# Altium project ETBC.PrjPcb
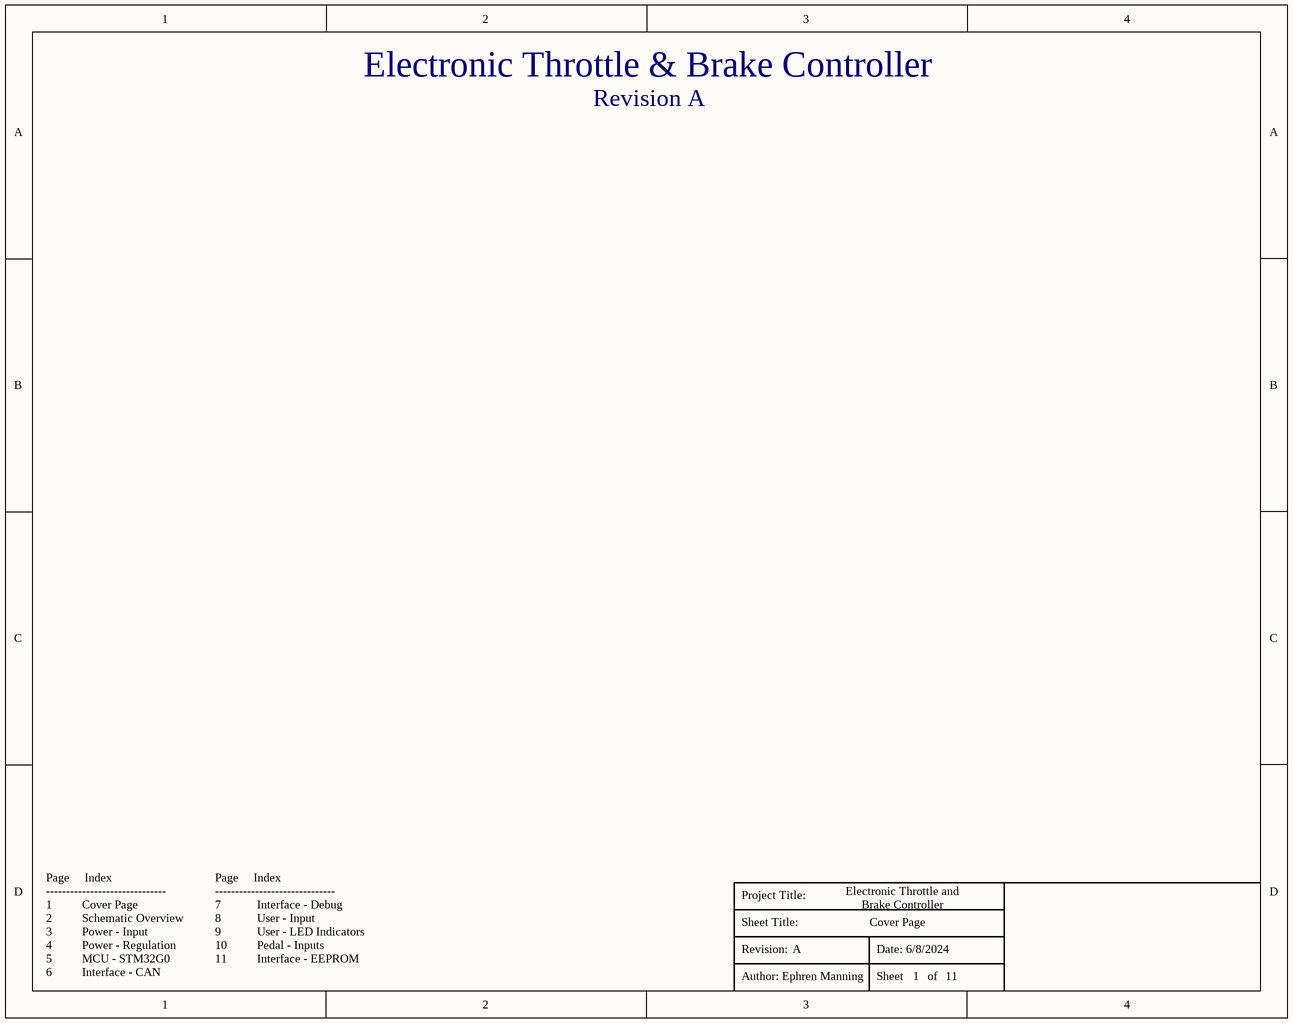
[diagram p0: Cover Page.SchDoc]
11 sheets, 104 parts. Net scope: hierarchical (ports join the sheet entries above them; power ports are global).
Board file: ETBC.PcbDoc
Sheets:
  Cover Page.SchDoc
  Overview.SchDoc
    MCU = MCU.SchDoc
    Interface - EEPROM = Interface - EEPROM.SchDoc
    Interface - CAN = Interface - CAN.SchDoc
    Interface - Debug = Interface - Debug.SchDoc
    Input - Pedals = Input - Pedals.SchDoc
    Power - Input = Power - Input.SchDoc
    Power - Regulation = Power - Regulation.SchDoc
    User - Input = User - Input.SchDoc
    User - LED Indicators = User - LED Indicators.SchDoc

## Sheet Cover Page.SchDoc
size A; SheetNumber: 1; SheetTotal: 11

### Notes on the sheet
- Electronic Throttle & Brake Controller
- Revision A
- Electronic Throttle and
  Brake Controller
- A
- Cover Page
- 6/8/2024
- Page     Index
  ------------------------------
  1          Cover Page
  2          Schematic Overview
  3          Power - Input
  4          Power - Regulation
  5          MCU - STM32G0
  6          Interface - CAN
- Page     Index
  ------------------------------
  7            Interface - Debug
  8            User - Input
  9            User - LED Indicators
  10          Pedal - Inputs
  11          Interface - EEPROM
- Ephren Manning
- 1
- 11
- Project Title:
- Sheet Title:
- Revision:
- Date:
- Author:
- Sheet        of

## Sheet Overview.SchDoc
size A; SheetNumber: 2; SheetTotal: 11
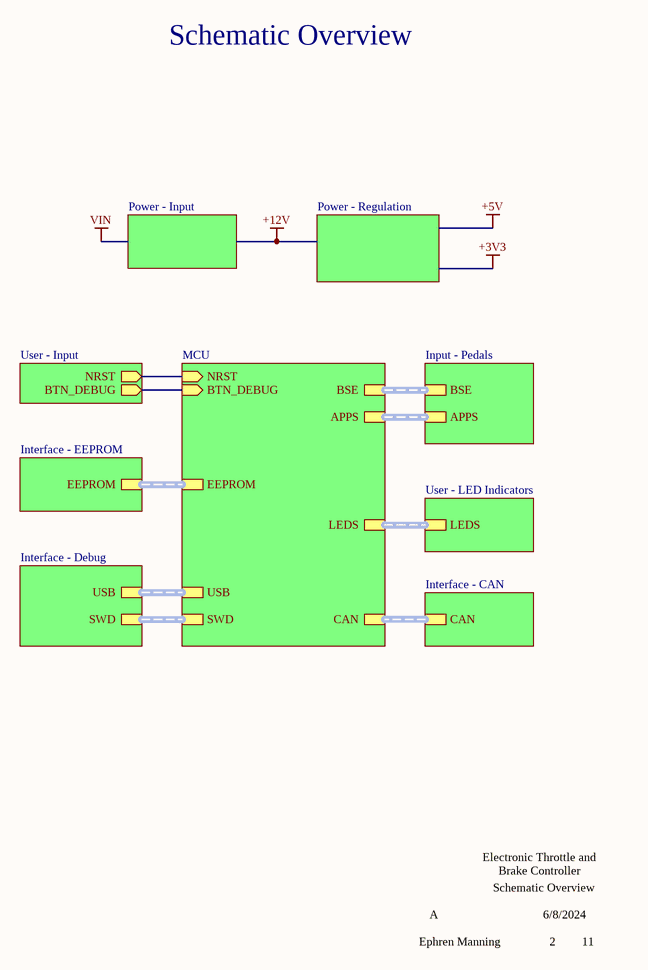
[diagram p1: Overview.SchDoc]

### Sub-sheets
Input - Pedals = Input - Pedals.SchDoc: BSE (harness BSE), APPS (harness APPS)
Interface - CAN = Interface - CAN.SchDoc: CAN (harness CAN)
Interface - Debug = Interface - Debug.SchDoc: SWD (harness SWD), USB (harness USB)
Interface - EEPROM = Interface - EEPROM.SchDoc: EEPROM (harness EEPROM)
MCU = MCU.SchDoc: CAN (harness CAN), SWD (harness SWD), USB (harness USB), LEDS (harness LEDS), EEPROM (harness EEPROM), APPS (harness APPS), BSE (harness BSE), NRST (in), BTN_DEBUG (in)
Power - Input = Power - Input.SchDoc: no entries
Power - Regulation = Power - Regulation.SchDoc: no entries
User - Input = User - Input.SchDoc: NRST (out), BTN_DEBUG (out)
User - LED Indicators = User - LED Indicators.SchDoc: LEDS (harness LEDS)

### Nets
BTN_DEBUG: sheet MCU/BTN_DEBUG, sheet User - Input/BTN_DEBUG
NRST: sheet MCU/NRST, sheet User - Input/NRST

### Buses and harness runs
harness sheet Input - Pedals/APPS = sheet MCU/APPS
harness sheet Input - Pedals/BSE = sheet MCU/BSE
harness sheet Interface - CAN/CAN = sheet MCU/CAN
harness sheet Interface - Debug/SWD = sheet MCU/SWD
harness sheet Interface - Debug/USB = sheet MCU/USB
harness sheet Interface - EEPROM/EEPROM = sheet MCU/EEPROM
harness sheet MCU/LEDS = sheet User - LED Indicators/LEDS

### Notes on the sheet
- Schematic Overview
- Electronic Throttle and
  Brake Controller
- A
- 6/8/2024
- Ephren Manning
- 2
- 11
- Project Title:
- Sheet Title:
- Revision:
- Date:
- Author:
- Sheet        of

## Sheet MCU.SchDoc
size A; SheetNumber: 5; SheetTotal: 11
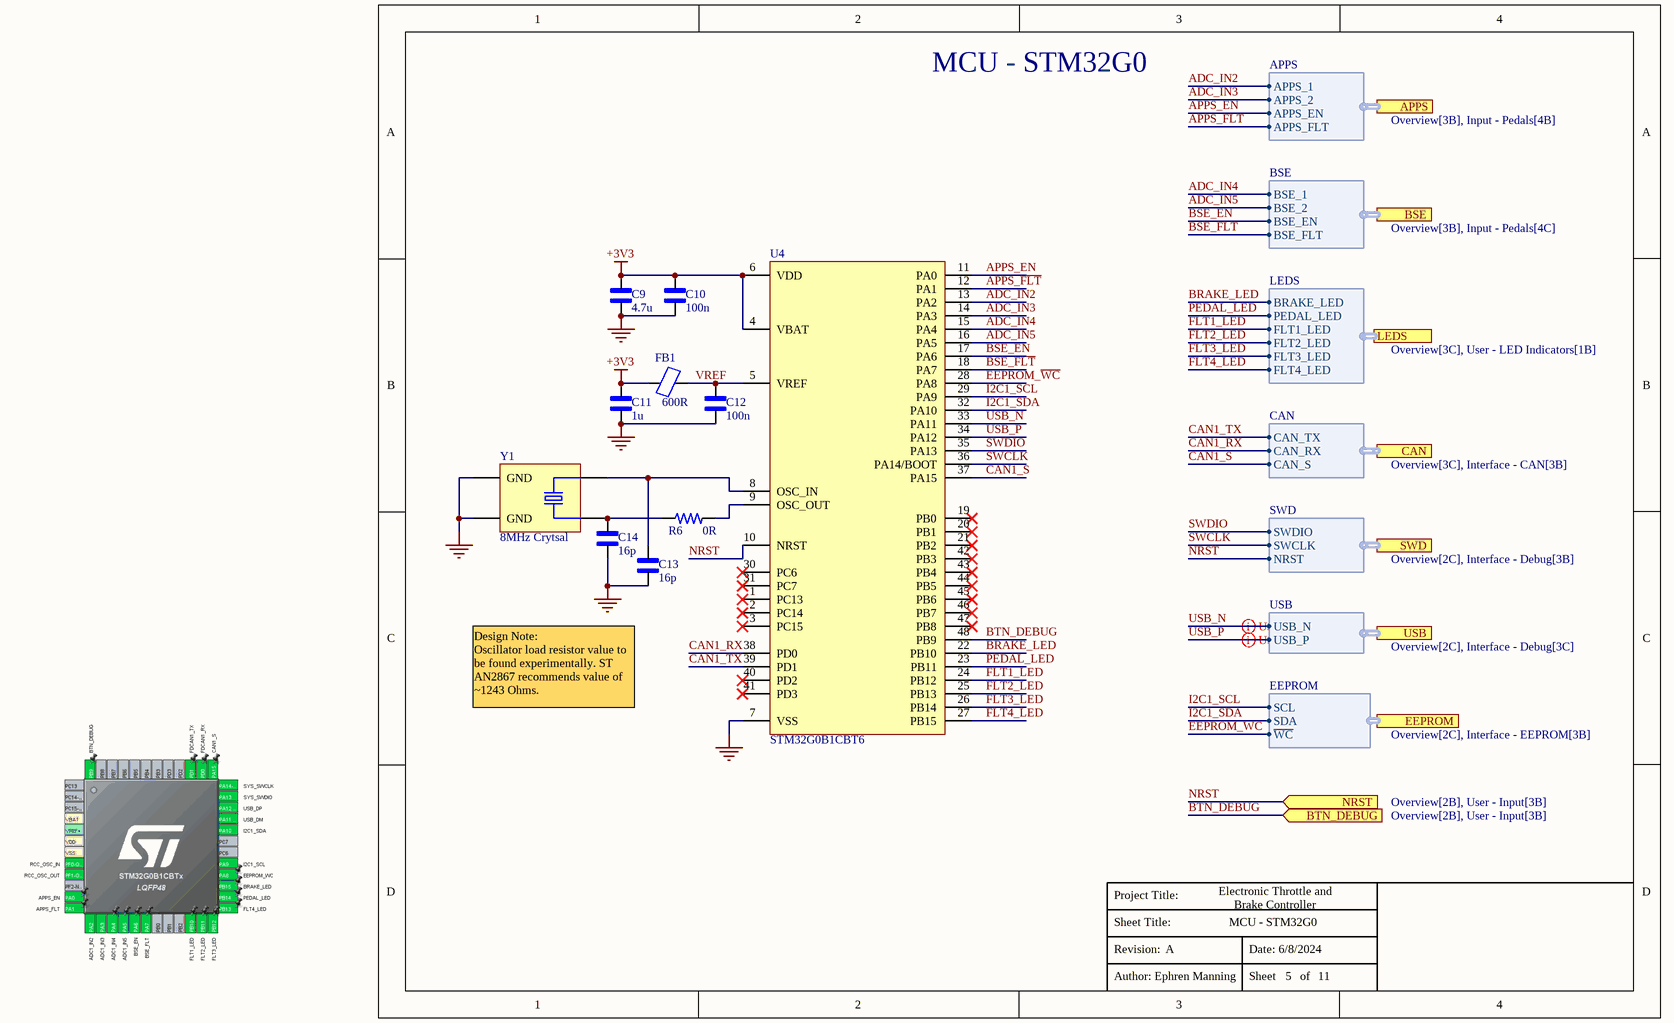
[diagram p2: MCU.SchDoc]

### Parts
C9  4.7u  [CAP_0402-Footprint-1]
C10  100n  [CAP_0402-Footprint-1]
C11  1u  [CAP_0402-Footprint-1]
C12  100n  [CAP_0402-Footprint-1]
C13  16p  [CAP_0402-Footprint-1]
C14  16p  [CAP_0402-Footprint-1]
FB1  600R  [FB_0402-Footprint-1]
R6  0R  [RES_0402-Footprint-1]
U4  STM32G0B1CBT6  [STM32G0-LQFP48]
Y1  ECS-80-18-33-JGN-TR  [XTAL_ECS-240-8-33-AGN-TR]  (value not drawn)

### Ports
APPS (harness APPS, see Overview[3B], Input - Pedals[4B]), BSE (harness BSE, see Overview[3B], Input - Pedals[4C]), BTN_DEBUG (in, see Overview[2B], User - Input[3B]), CAN (harness CAN, see Overview[3C], Interface - CAN[3B]), EEPROM (harness EEPROM, see Overview[2C], Interface - EEPROM[3B]), LEDS (harness LEDS, see Overview[3C], User - LED Indicators[1B]), NRST (in, see Overview[2B], User - Input[3B]), SWD (harness SWD, see Overview[2C], Interface - Debug[3B]), USB (harness USB, see Overview[2C], Interface - Debug[3C])

### Harnesses
CAN: CAN_TX, CAN_RX, CAN_S
SWD: SWDIO, SWCLK, NRST
USB: USB_N, USB_P
LEDS: BRAKE_LED, PEDAL_LED, FLT1_LED, FLT2_LED, FLT3_LED, FLT4_LED
EEPROM: SCL, SDA, ~{WC}
APPS: APPS_1, APPS_2, APPS_EN, APPS_FLT
BSE: BSE_1, BSE_2, BSE_EN, BSE_FLT

### Nets
+3V3: C9.2 C10.2 C11.2 FB1.1 U4.4(VBAT) U4.6(VDD)
GND: C9.1 C10.1 C11.1 C12.1 C13.2 C14.1 U4.7(VSS) Y1.2(GND) Y1.4(GND)
ADC_IN2: U4.13(PA2) ; port APPS.APPS_1
ADC_IN3: U4.14(PA3) ; port APPS.APPS_2
ADC_IN4: U4.15(PA4) ; port BSE.BSE_1
ADC_IN5: U4.16(PA5) ; port BSE.BSE_2
APPS_EN: U4.11(PA0) ; port APPS.APPS_EN
APPS_~{FLT}: U4.12(PA1) ; port APPS.APPS_FLT
BRAKE_LED: U4.22(PB10) ; port LEDS.BRAKE_LED
BSE_EN: U4.17(PA6) ; port BSE.BSE_EN
BSE_~{FLT}: U4.18(PA7) ; port BSE.BSE_FLT
BTN_DEBUG: U4.48(PB9) ; port BTN_DEBUG
CAN1_RX: U4.38(PD0) ; port CAN.CAN_RX
CAN1_S: U4.37(PA15) ; port CAN.CAN_S
CAN1_TX: U4.39(PD1) ; port CAN.CAN_TX
EEPROM_~{WC}: U4.28(PA8) ; port EEPROM.~{WC}
FLT1_LED: U4.24(PB12) ; port LEDS.FLT1_LED
FLT2_LED: U4.25(PB13) ; port LEDS.FLT2_LED
FLT3_LED: U4.26(PB14) ; port LEDS.FLT3_LED
FLT4_LED: U4.27(PB15) ; port LEDS.FLT4_LED
I2C1_SCL: U4.29(PA9) ; port EEPROM.SCL
I2C1_SDA: U4.32(PA10) ; port EEPROM.SDA
NRST: U4.10(NRST) ; port NRST, port SWD.NRST
PEDAL_LED: U4.23(PB11) ; port LEDS.PEDAL_LED
SWCLK: U4.36(PA14/BOOT) ; port SWD.SWCLK
SWDIO: U4.35(PA13) ; port SWD.SWDIO
USB_N: U4.33(PA11) ; port USB.USB_N
USB_P: U4.34(PA12) ; port USB.USB_P
VREF: C12.2 FB1.2 U4.5(VREF)
NetC13_1: C13.1 U4.8(OSC_IN) Y1.1(IN/OUT)
NetC14_2: C14.2 R6.1 Y1.3(OUT/IN)
NetR6_2: R6.2 U4.9(OSC_OUT)

Not connected (* = marked no-connect by the designer): U4 1(PC13)* 2(PC14)* 3(PC15)* 19(PB0)* 20(PB1)* 21(PB2)* 30(PC6)* 31(PC7)* 40(PD2)* 41(PD3)* 42(PB3)* 43(PB4)* 44(PB5)* 45(PB6)* 46(PB7)* 47(PB8)*

### Layout directives
differential pair: USB_N, USB_P

### Notes on the sheet
- MCU - STM32G0
- (near Y1) 8MHz Crytsal
- Design Note:
  Oscillator load resistor value to be found experimentally. ST AN2867 recommends value of ~1243 Ohms.
- Electronic Throttle and
  Brake Controller
- A
- 6/8/2024
- Ephren Manning
- 5
- 11
- Project Title:
- Sheet Title:
- Revision:
- Date:
- Author:
- Sheet        of

### Library data of the parts
C9 = CMP-00067-3: 4.7uF 10V 20% 0402 CAP; Manufacturer Part Number 1: CL05A475MP5NRNC; Manufacturer 1: Samsung Electro-Mechanics; Digikey Part Number: 1276-1482-1-ND
C10 C12 = CMP-00066-3: 100nF 10V 10% 0402 CAP; Manufacturer 1: Samsung Electro-Mechanics; Manufacturer Part Number 1: CL05B104KP5NNNC; Digikey Part Number: 1276-1002-1-ND
C11 = CMP-00068-3: 1uF 10V 10% 0402 CAP; Manufacturer Part Number 1: CL05A105KP5NNNC; Manufacturer 1: Samsung Electro-Mechanics; Digikey Part Number: 1276-1076-1-ND
C13 C14 = CMP-00065-1: 16pF 50V 1% 0402 Ceramic Capacitor; Manufacturer Part Number 1: GJM1555C1H160FB01J; Manufacturer 1: Murata Electronics; Digikey Part Number: 490-GJM1555C1H160FB01JCT-ND
FB1 = CMP-00069-1: 600R@100MHz 300mA 0402 Ferrite Bead; Manufacturer 1: Murata Electronics; Manufacturer Part Number 1: BLM15AG601SN1D; Digikey Part Number: 490-1006-1-ND
R6 = CMP-00070-1: 0 Ohm 1/16W 0402 Resistor; Manufacturer 1: YAGEO; Manufacturer Part Number 1: RC0402JR-070RL; Digikey Part Number: 311-0.0JRCT-ND
U4 = CMP-00062-7: 32-bit Cortex-M0+ MCU 48LQFP; Manufacturer 1: STMicroelectronics; Digikey Part Number: 497-STM32G0B1CBT6-ND; Manufacturer Part Number 1: STM32G0B1CBT6
Y1 = CMP-128-000000-3: 8MHz ±20ppm 18pF Crystal; Manufacturer 1: ECS Inc.; Digikey Part Number: 50-ECS-80-18-33-JGN-CT-ND; Manufacturer Part Number 1: ECS-80-18-33-JGN-TR

## Sheet Interface - EEPROM.SchDoc
size A; SheetNumber: 11; SheetTotal: 11
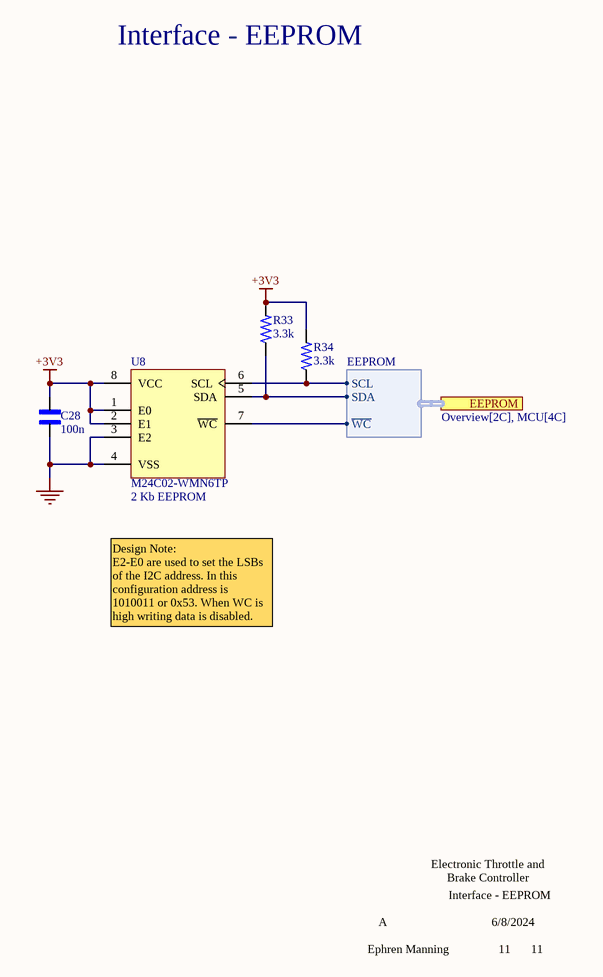
[diagram p3: Interface - EEPROM.SchDoc]

### Parts
C28  100n  [CAP_0402-Footprint-1]
R33  3.3k  [RES_0402-Footprint-1]
R34  3.3k  [RES_0402-Footprint-1]
U8  M24C02-WMN6TP  [FP-SO8N-SO-A-IPC_B]

### Ports
EEPROM (harness EEPROM, see Overview[2C], MCU[4C])

### Harnesses
EEPROM: SCL, SDA, ~{WC}

### Nets
+3V3: C28.2 R33.2 R34.2 U8.1(E0) U8.2(E1) U8.8(VCC)
GND: C28.1 U8.3(E2) U8.4(VSS)
EEPROM_~{WC}: U8.7(~{WC}) ; port EEPROM.~{WC}
I2C1_SCL: R34.1 U8.6(SCL) ; port EEPROM.SCL
I2C1_SDA: R33.1 U8.5(SDA) ; port EEPROM.SDA

### Notes on the sheet
- Interface - EEPROM
- (near U8) 2 Kb EEPROM
- Design Note:
  E2-E0 are used to set the LSBs of the I2C address. In this configuration address is 1010011 or 0x53. When WC is high writing data is disabled.
- Electronic Throttle and
  Brake Controller
- A
- 6/8/2024
- Ephren Manning
- 11
- Project Title:
- Sheet Title:
- Revision:
- Date:
- Author:
- Sheet        of

### Library data of the parts
C28 = CMP-00066-3: 100nF 10V 10% 0402 CAP; Manufacturer Part Number 1: CL05B104KP5NNNC; Manufacturer 1: Samsung Electro-Mechanics; Digikey Part Number: 1276-1002-1-ND
R33 R34 = CMP-00091-1: 3.3k 1% 1/16W 0402 Thick Film; Manufacturer 1: YAGEO; Manufacturer Part Number 1: RC0402FR-073K3L; Digikey Part Number: 311-3.30KLRCT-ND
U8 = CMP-00089-1: 2Kb I2C EEPROM; Manufacturer 1: STMicroelectronics; Manufacturer Part Number 1: M24C02-WMN6TP; Digikey Part Number: 497-8552-1-ND

## Sheet Interface - CAN.SchDoc
size A; SheetNumber: 6; SheetTotal: 11
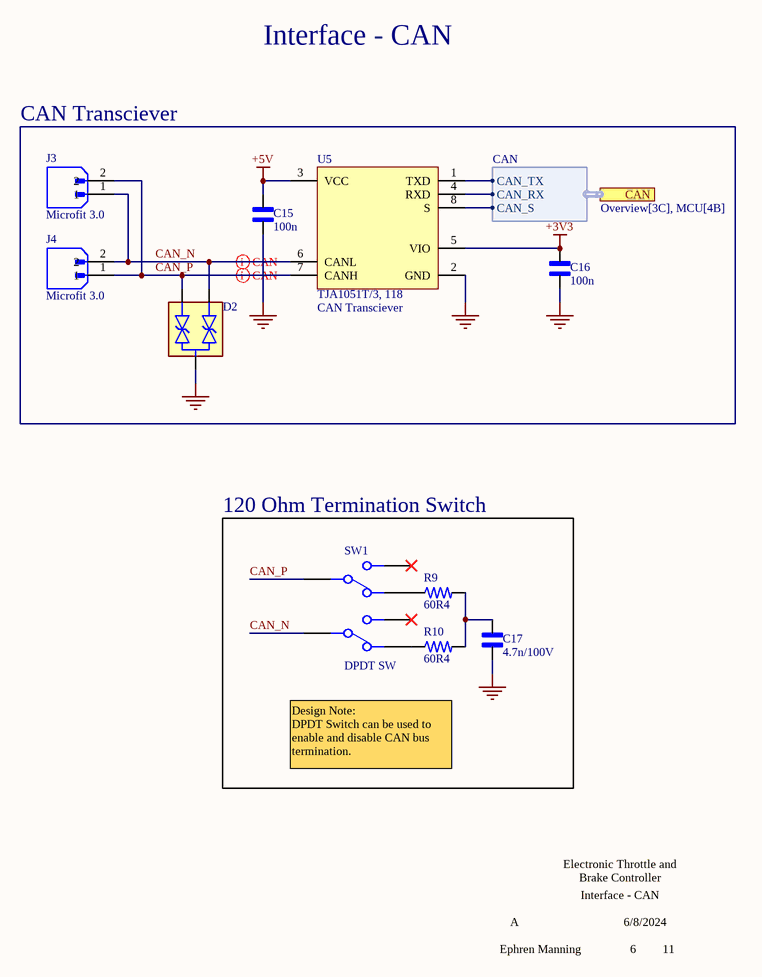
[diagram p4: Interface - CAN.SchDoc]

### Parts
C15  100n  [CAP_0402-Footprint-1]
C16  100n  [CAP_0402-Footprint-1]
C17  4.7n/100V  [CAP_0402-Footprint-1]
D2  ESD2CANFD24DBZRQ1  [SOT95P237X112-3N]  (value not drawn)
J3  Microfit 3.0  [MOLEX_436500216]
J4  Microfit 3.0  [MOLEX_436500216]
R9  60R4  [RES_0402-Footprint-1]
R10  60R4  [RES_0402-Footprint-1]
SW1  DPDT SW  [SW_JS202011JCQN]
U5  TJA1051T/3, 118  [SOIC127P600X175-8N]

### Blocks framed on the sheet
CAN Transciever: C15 C16 D2 J3 J4 U5
120 Ohm Termination Switch: C17 R9 R10 SW1

### Ports
CAN (harness CAN, see Overview[3C], MCU[4B])

### Harnesses
CAN: CAN_TX, CAN_RX, CAN_S

### Nets
+3V3: C16.2 U5.5(VIO)
+5V: C15.2 U5.3(VCC)
GND: C15.1 C16.1 C17.1 D2.3(GND) U5.2(GND)
CAN1_RX: U5.4(RXD) ; port CAN.CAN_RX
CAN1_S: U5.8(S) ; port CAN.CAN_S
CAN1_TX: U5.1(TXD) ; port CAN.CAN_TX
CAN_N: D2.1(IO1) J3.1 J4.2 SW1.6 U5.6(CANL)
CAN_P: D2.2(IO2) J3.2 J4.1 SW1.2 U5.7(CANH)
NetC17_2: C17.2 R9.2 R10.2
NetR9_1: R9.1 SW1.3
NetR10_1: R10.1 SW1.7

Not connected (* = marked no-connect by the designer): SW1 1* 5*

### Layout directives
differential pair: CAN_N, CAN_P

### Notes on the sheet
- Interface - CAN
- (near U5) CAN Transciever
- Design Note:
  DPDT Switch can be used to enable and disable CAN bus termination.
- Electronic Throttle and
  Brake Controller
- A
- 6/8/2024
- Ephren Manning
- 6
- 11
- Project Title:
- Sheet Title:
- Revision:
- Date:
- Author:
- Sheet        of

### Library data of the parts
C15 C16 = CMP-00066-3: as C28 on sheet Interface - EEPROM; Digikey Part Number: 1276-1002-1-ND
C17 = CMP-00072-1: 4.7nF 100V 10% 0402 Ceramic Capacitor; Manufacturer 1: Murata Electronics; Manufacturer Part Number 1: GCM155R72A472KA37D; Digikey Part Number: 490-4765-1-ND
D2 = CMP-112-000000-3: Dual TVS Protection Diodes; Manufacturer 1: Texas Instruments; Digikey Part Number: 296-ESD2CANFD24DBZRQ1CT-ND; Manufacturer Part number 1: ESD2CANFD24DBZRQ1
J3 J4 = CMP-085-000002-2: 1x2 Gold Microfit; Manufacturer Part Number 1: 43650-0216; Manufacturer 1: Molex; Digikey Part Number: WM1922-ND
R9 R10 = CMP-00071-1: 60.4 Ohm 1% 1/16W 0402 Resistor; Manufacturer Part Number 1: RC0402FR-0760R4L; Manufacturer 1: YAGEO; Digikey Part Number: 311-60.4LRCT-ND
SW1 = CMP-114-000000-2: DPDT SMD SWITCH 6V 300MA; Manufacturer 1: C&K; Manufacturer Part Number 1: JS202011JCQN; Digikey Part Number: CKN10723CT-ND
U5 = CMP-00010-11: CAN Transceiver, NXP; Manufacturer 1: NXP USA Inc.; Manufacturer Part Number 1: TJA1051T/3,118; Digikey Part Number: 568-8684-1-ND

## Sheet Interface - Debug.SchDoc
size A; SheetNumber: 7; SheetTotal: 11
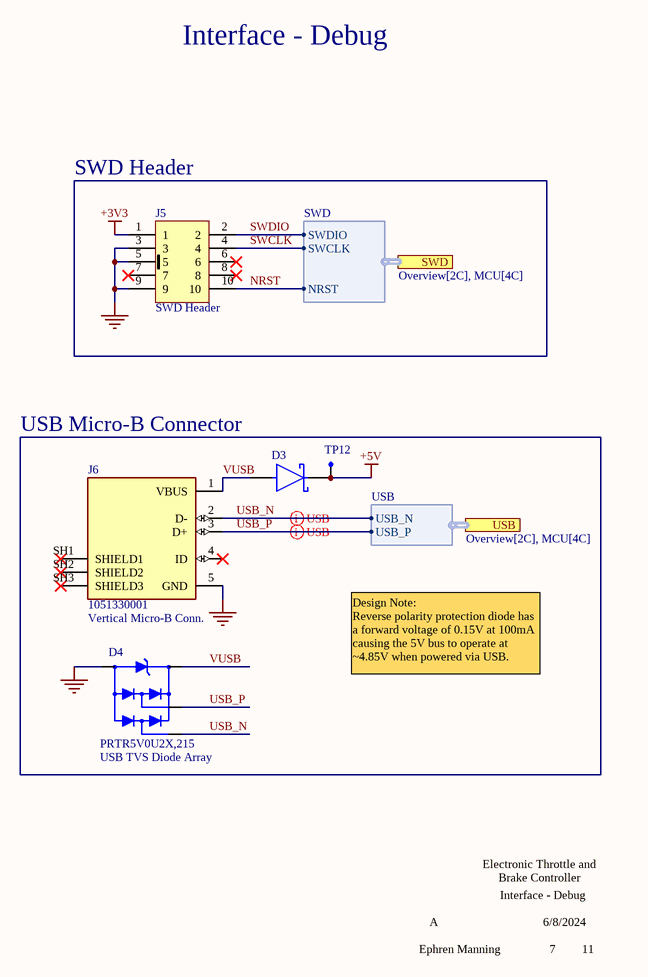
[diagram p5: Interface - Debug.SchDoc]

### Parts
D3  LSM115JE3/TR13  [DIOM4336X33N]  (value not drawn)
D4  PRTR5V0U2X,215  [SOT143B]
J5  SWD Header  [FCI_20021111-00010T4LF]
J6  1051330001  [MOLEX_1051330001]
TP12  SMD Testpoint  [SMD Testpoint-Footprint-1]  (value not drawn)

### Blocks framed on the sheet
SWD Header: J5
USB Micro-B Connector: D3 D4 J6 TP12

### Ports
SWD (harness SWD, see Overview[2C], MCU[4C]), USB (harness USB, see Overview[2C], MCU[4C])

### Harnesses
SWD: SWDIO, SWCLK, NRST
USB: USB_N, USB_P

### Nets
+3V3: J5.1
+5V: D3.2 TP12.1
GND: D4.1(P$1) J5.3 J5.5 J5.9 J6.5(GND)
NRST: J5.10 ; port SWD.NRST
SWCLK: J5.4 ; port SWD.SWCLK
SWDIO: J5.2 ; port SWD.SWDIO
USB_N: D4.3(P$3) J6.2(D-) ; port USB.USB_N
USB_P: D4.2(P$2) J6.3(D+) ; port USB.USB_P
VUSB: D3.1 D4.4(P$4) J6.1(VBUS)

Not connected (* = marked no-connect by the designer): J5 6* 7* 8*; J6 4(ID)* SH1(SHIELD1)* SH2(SHIELD2)* SH3(SHIELD3)*

### Layout directives
differential pair: USB_N, USB_P

### Notes on the sheet
- Interface - Debug
- Vertical Micro-B Conn.
- Design Note:
  Reverse polarity protection diode has a forward voltage of 0.15V at 100mA causing the 5V bus to operate at ~4.85V when powered via USB.
- (near D4) USB TVS Diode Array
- Electronic Throttle and
  Brake Controller
- A
- 6/8/2024
- Ephren Manning
- 7
- 11
- Project Title:
- Sheet Title:
- Revision:
- Date:
- Author:
- Sheet        of

### Library data of the parts
D3 = CMP-00073-1: 15V 1A Schottky Diode, Very Low Forward Voltage; Manufacturer 1: Microchip Technology; Digikey Part Number: 150-LSM115JE3/TR13CT-ND; Manufacturer Part Number 1: LSM115JE3/TR13
D4 = CMP-018-000000-5: Diode Array, ESD; Manufacturer 1: Nexperia USA Inc.; Manufacturer Part Number 1: PRTR5V0U2X,215; Digikey Part Number: 1727-3884-1-ND
J5 = CMP-118-000000-2: SWD Unshrouded Connector; Manufacturer 1: Amphenol ICC (FCI); Digikey Part Number: 609-3712-ND; Manufacturer Part Number 1: 20021111-00010T4LF
J6 = CMP-016-000000-6: Micro USB Type B 90 Degree Conn; Manufacturer 1: Molex; Manufacturer Part Number 1: 1051330001; Digikey Part Number: WM9734CT-ND
TP12 = CMP-00095-4: Flat 50x50mil Test Point

## Sheet Input - Pedals.SchDoc
size A; SheetNumber: 10; SheetTotal: 11
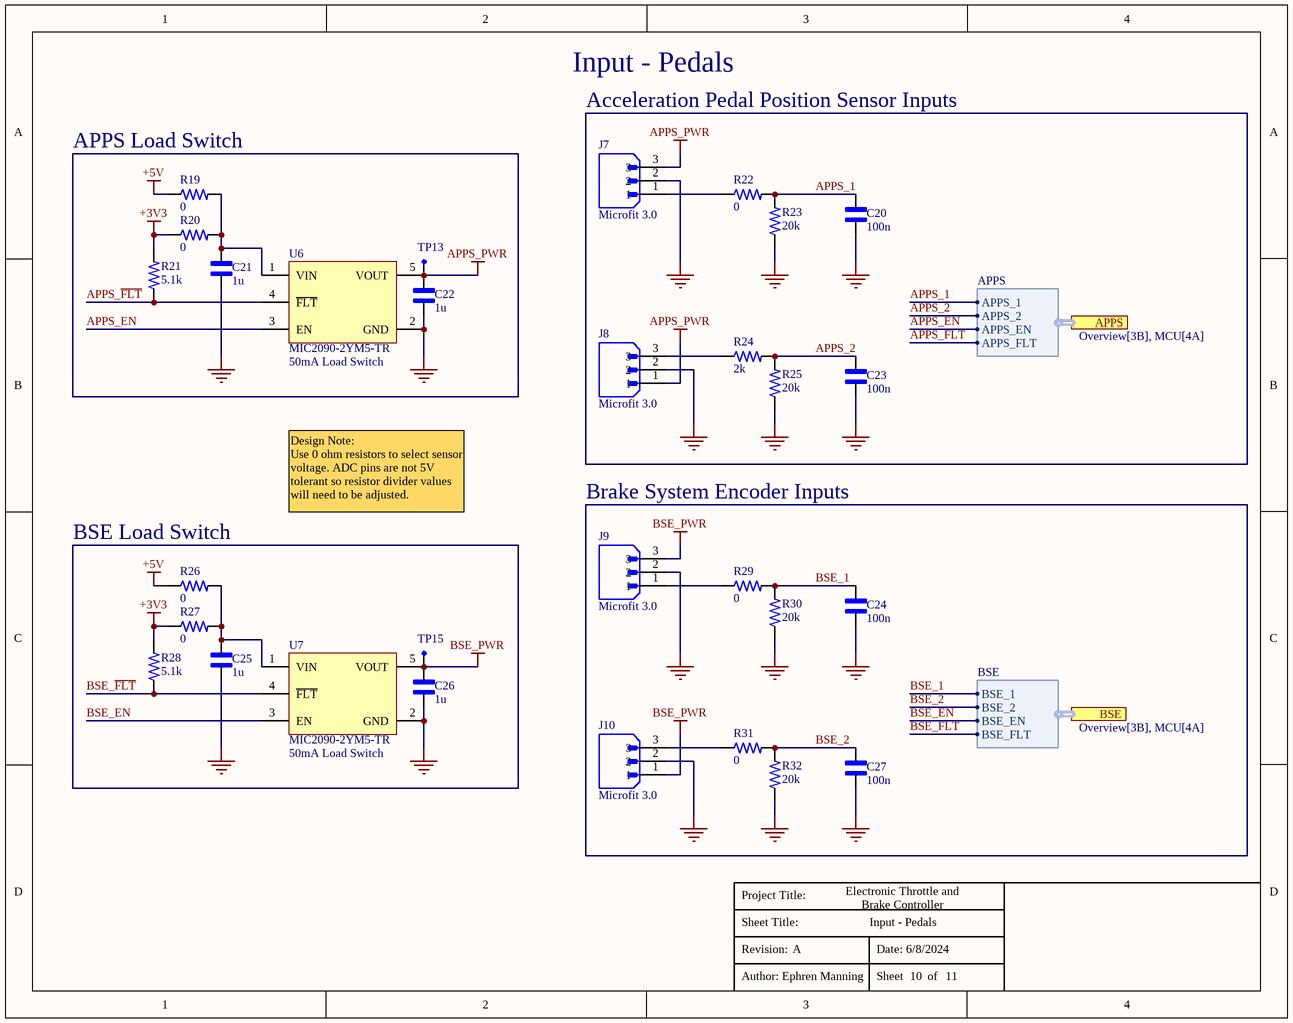
[diagram p6: Input - Pedals.SchDoc]

### Parts
C20  100n  [CAP_0402-Footprint-1]
C21  1u  [CAP_0402-Footprint-1]
C22  1u  [CAP_0402-Footprint-1]
C23  100n  [CAP_0402-Footprint-1]
C24  100n  [CAP_0402-Footprint-1]
C25  1u  [CAP_0402-Footprint-1]
C26  1u  [CAP_0402-Footprint-1]
C27  100n  [CAP_0402-Footprint-1]
J7  Microfit 3.0  [MOLEX_436500316]
J8  Microfit 3.0  [MOLEX_436500316]
J9  Microfit 3.0  [MOLEX_436500316]
J10  Microfit 3.0  [MOLEX_436500316]
R19  0  [RES_0402-Footprint-1]
R20  0  [RES_0402-Footprint-1]
R21  5.1k  [RES_0402-Footprint-1]
R22  0  [RES_0402-Footprint-1]
R23  20k  [RES_0402-Footprint-1]
R24  2k  [RES_0402-Footprint-1]
R25  20k  [RES_0402-Footprint-1]
R26  0  [RES_0402-Footprint-1]
R27  0  [RES_0402-Footprint-1]
R28  5.1k  [RES_0402-Footprint-1]
R29  0  [RES_0402-Footprint-1]
R30  20k  [RES_0402-Footprint-1]
R31  0  [RES_0402-Footprint-1]
R32  20k  [RES_0402-Footprint-1]
TP13  SMD Testpoint  [SMD Testpoint-Footprint-1]  (value not drawn)
TP15  SMD Testpoint  [SMD Testpoint-Footprint-1]  (value not drawn)
U6  MIC2090-2YM5-TR  [SOT95P275X110-5N]
U7  MIC2090-2YM5-TR  [SOT95P275X110-5N]

### Blocks framed on the sheet
Acceleration Pedal Position Sensor Inputs: C20 C23 J7 J8 R22-R25
APPS Load Switch: C21 C22 R19-R21 TP13 U6
Brake System Encoder Inputs: C24 C27 J9 J10 R29-R32
BSE Load Switch: C25 C26 R26-R28 TP15 U7

### Ports
APPS (harness APPS, see Overview[3B], MCU[4A]), BSE (harness BSE, see Overview[3B], MCU[4A])

### Harnesses
BSE: BSE_1, BSE_2, BSE_EN, BSE_FLT
APPS: APPS_1, APPS_2, APPS_EN, APPS_FLT

### Nets
+3V3: R20.1 R21.2 R27.1 R28.2
+5V: R19.1 R26.1
APPS_PWR: C22.2 J7.3 J8.1 TP13.1 U6.5(VOUT)
BSE_PWR: C26.2 J9.3 J10.1 TP15.1 U7.5(VOUT)
GND: C20.1 C21.1 C22.1 C23.1 C24.1 C25.1 C26.1 C27.1 J7.2 J8.2 J9.2 J10.2 R23.1 R25.1 R30.1 R32.1 U6.2(GND) U7.2(GND)
APPS_1: C20.2 R22.2 R23.2 ; port APPS.APPS_1  [project net ADC_IN2]
APPS_2: C23.2 R24.2 R25.2 ; port APPS.APPS_2  [project net ADC_IN3]
APPS_EN: U6.3(EN) ; port APPS.APPS_EN
APPS_~{FLT}: R21.1 U6.4(~{FLT}) ; port APPS.APPS_FLT
BSE_1: C24.2 R29.2 R30.2 ; port BSE.BSE_1  [project net ADC_IN4]
BSE_2: C27.2 R31.2 R32.2 ; port BSE.BSE_2  [project net ADC_IN5]
BSE_EN: U7.3(EN) ; port BSE.BSE_EN
BSE_~{FLT}: R28.1 U7.4(~{FLT}) ; port BSE.BSE_FLT
NetC21_2: C21.2 R19.2 R20.2 U6.1(VIN)
NetC25_2: C25.2 R26.2 R27.2 U7.1(VIN)
NetJ7_1: J7.1 R22.1
NetJ8_3: J8.3 R24.1
NetJ9_1: J9.1 R29.1
NetJ10_3: J10.3 R31.1

### Notes on the sheet
- Input - Pedals
- (near U6) 50mA Load Switch
- Design Note:
  Use 0 ohm resistors to select sensor voltage. ADC pins are not 5V tolerant so resistor divider values will need to be adjusted.
- (near U7) 50mA Load Switch
- Electronic Throttle and
  Brake Controller
- A
- 6/8/2024
- Ephren Manning
- 10
- 11
- Project Title:
- Sheet Title:
- Revision:
- Date:
- Author:
- Sheet        of

### Library data of the parts
C20 C23 C24 C27 = CMP-00066-3: as C28 on sheet Interface - EEPROM; Digikey Part Number: 1276-1002-1-ND
C21 C22 C25 C26 = CMP-00068-3: 1uF 10V 10% 0402 CAP; Manufacturer 1: Samsung Electro-Mechanics; Manufacturer Part Number 1: CL05A105KP5NNNC; Digikey Part Number: 1276-1076-1-ND
J7-J10 = CMP-085-000001-2: 1x3 Gold Microfit; Manufacturer 1: Molex; Manufacturer Part Number 1: 436500316; Digikey Part Number: WM1923-ND
R19 R20 R22 R26 R27 R29 R31 = CMP-00070-1: as R6 on sheet MCU; Digikey Part Number: 311-0.0JRCT-ND
R21 R28 = CMP-00074-1: 5.1k 1% 1/16W 0402 Resistor; Manufacturer 1: YAGEO; Manufacturer Part Number 1: RC0402FR-075K1L; Digikey Part Number: 311-5.10KLRCT-ND
R23 R25 R30 R32 = CMP-00081-1: 20k 0.1% 1/16W 0402 Thin Film; Manufacturer 1: YAGEO; Manufacturer Part Number 1: RT0402BRD0720KL; Digikey Part Number: YAG1388CT-ND
R24 = CMP-00080-1: 2k 0.1% 1/16W 0402 Thin Film; Manufacturer 1: YAGEO; Manufacturer Part Number 1: RT0402BRD072KL; Digikey Part Number: YAG2303CT-ND
TP13 TP15 = CMP-00095-4: Flat 50x50mil Test Point
U6 U7 = CMP-00085-1: 50mA Load Switch w/ Overcurrent Protection; Manufacturer 1: Microchip Technology; Digikey Part Number: 576-3964-1-ND; Manufacturer Part Number 1: MIC2090-2YM5-TR

## Sheet Power - Input.SchDoc
size A; SheetNumber: 3; SheetTotal: 11
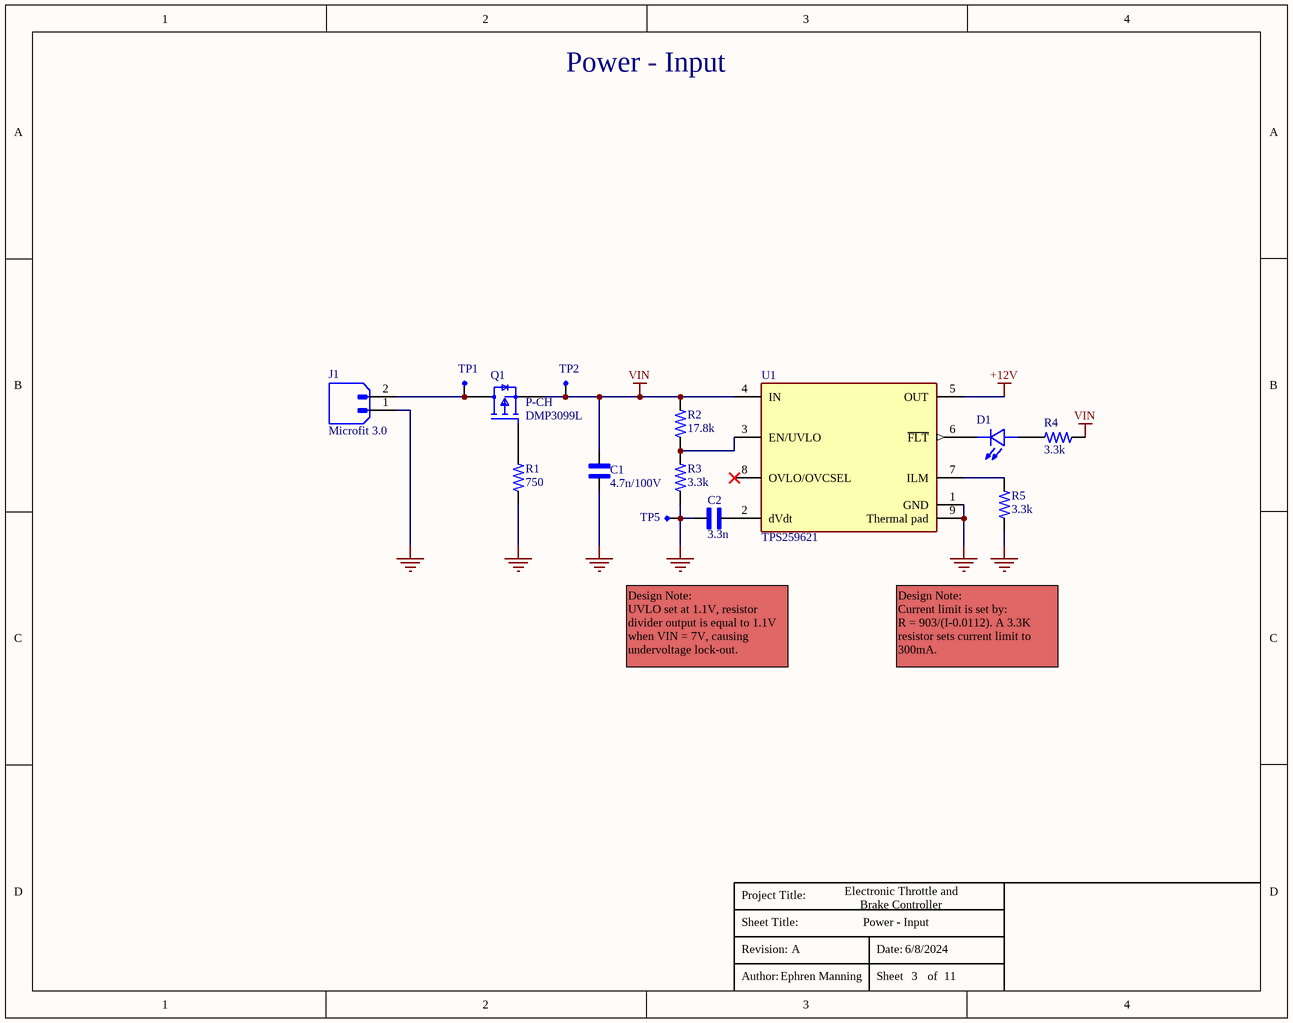
[diagram p7: Power - Input.SchDoc]

### Parts
C1  4.7n/100V  [CAP_0402-Footprint-1]
C2  3.3n  [CAP_0402-Footprint-1]
D1  150060RS75000  [LED_150060RS75000]  (value not drawn)
J1  Microfit 3.0  [MOLEX_436500216]
Q1  DMP3099L  [SOT95P242X110-3N]
R1  750  [RES_0402-Footprint-1]
R2  17.8k  [RES_0402-Footprint-1]
R3  3.3k  [RES_0402-Footprint-1]
R4  3.3k  [RES_0402-Footprint-1]
R5  3.3k  [RES_0402-Footprint-1]
TP1  SMD Testpoint  [SMD Testpoint-Footprint-1]  (value not drawn)
TP2  SMD Testpoint  [SMD Testpoint-Footprint-1]  (value not drawn)
TP5  SMD Testpoint  [SMD Testpoint-Footprint-1]  (value not drawn)
U1  TPS259621  [FP-DDA0008E-IPC_B]

### Nets
+12V: U1.5(OUT)
GND: C1.1 C2.1 J1.1 R1.1 R3.1 R5.1 TP5.1 U1.1(GND) U1.9(Thermal_pad)
VIN: C1.2 Q1.2(Source) R2.2 R4.1 TP2.1 U1.4(IN)
NetC2_2: C2.2 U1.2(dVdt)
NetD1_A: D1.A R4.2
NetD1_C: D1.C U1.6(~{FLT})
NetJ1_2: J1.2 Q1.3(Drain) TP1.1
NetQ1_1: Q1.1(Gate) R1.2
NetR2_1: R2.1 R3.2 U1.3(EN/UVLO)
NetR5_2: R5.2 U1.7(ILM)

Not connected (* = marked no-connect by the designer): U1 8(OVLO/OVCSEL)*

### Notes on the sheet
- Power - Input
- (near Q1) P-CH
- Design Note:
  UVLO set at 1.1V, resistor divider output is equal to 1.1V when VIN = 7V, causing undervoltage lock-out.
- Design Note:
  Current limit is set by:
  R = 903/(I-0.0112). A 3.3K resistor sets current limit to 300mA.
- Electronic Throttle and
  Brake Controller
- A
- 6/8/2024
- Ephren Manning
- 3
- 11
- Project Title:
- Sheet Title:
- Revision:
- Date:
- Author:
- Sheet        of

### Library data of the parts
C1 = CMP-00072-1: as C17 on sheet Interface - CAN; Digikey Part Number: 490-4765-1-ND
C2 = CMP-00088-1: 3.3nF 25V 0402 Ceramic Capacitor; Manufacturer 1: YAGEO; Manufacturer Part Number 1: CC0402KRX7R8BB332; Digikey Part Number: 311-3623-1-ND
D1 = CMP-120-000000-3: CLEAR RED LEAD 0603 2V Forward Voltage; Manufacturer 1: Würth Elektronik; Manufacturer Part Number 1: 150060RS75000; Digikey Part Number: 732-4978-1-ND
J1 = CMP-085-000002-2: as J3 on sheet Interface - CAN; Digikey Part Number: WM1922-ND
Q1 = CMP-00025-2: Mosfet P-CH 30V 3.8A Vgs(ON) = -10V SOT23; Manufacturer Part Number 1: DMP3099L-7; Manufacturer 1: Diodes Incorporated; Digikey Part Number: DMP3099L-7DICT-ND
R1 = CMP-00078-1: 750 1% 1/16W 0402 Thick Film; Manufacturer Part Number 1: RC0402FR-07750RL; Manufacturer 1: YAGEO; Digikey Part Number: 311-750LRCT-ND
R2 = CMP-00090-1: 17.8k 1% 1/16W 0402 Thick Film; Manufacturer 1: YAGEO; Manufacturer Part Number 1: RC0402FR-0717K8L; Digikey Part Number: YAG3012CT-ND
R3-R5 = CMP-00091-1: as R33 on sheet Interface - EEPROM; Digikey Part Number: 311-3.30KLRCT-ND
TP1 TP2 TP5 = CMP-00095-4: Flat 50x50mil Test Point
U1 = CMP-00086-2: 19V 2A EFUSE; Manufacturer 1: Texas Instruments; Manufacturer Part Number 1: TPS259621DDAT; Digikey Part Number: 296-TPS259621DDATCT-ND

## Sheet Power - Regulation.SchDoc
size A; SheetNumber: 4; SheetTotal: 11
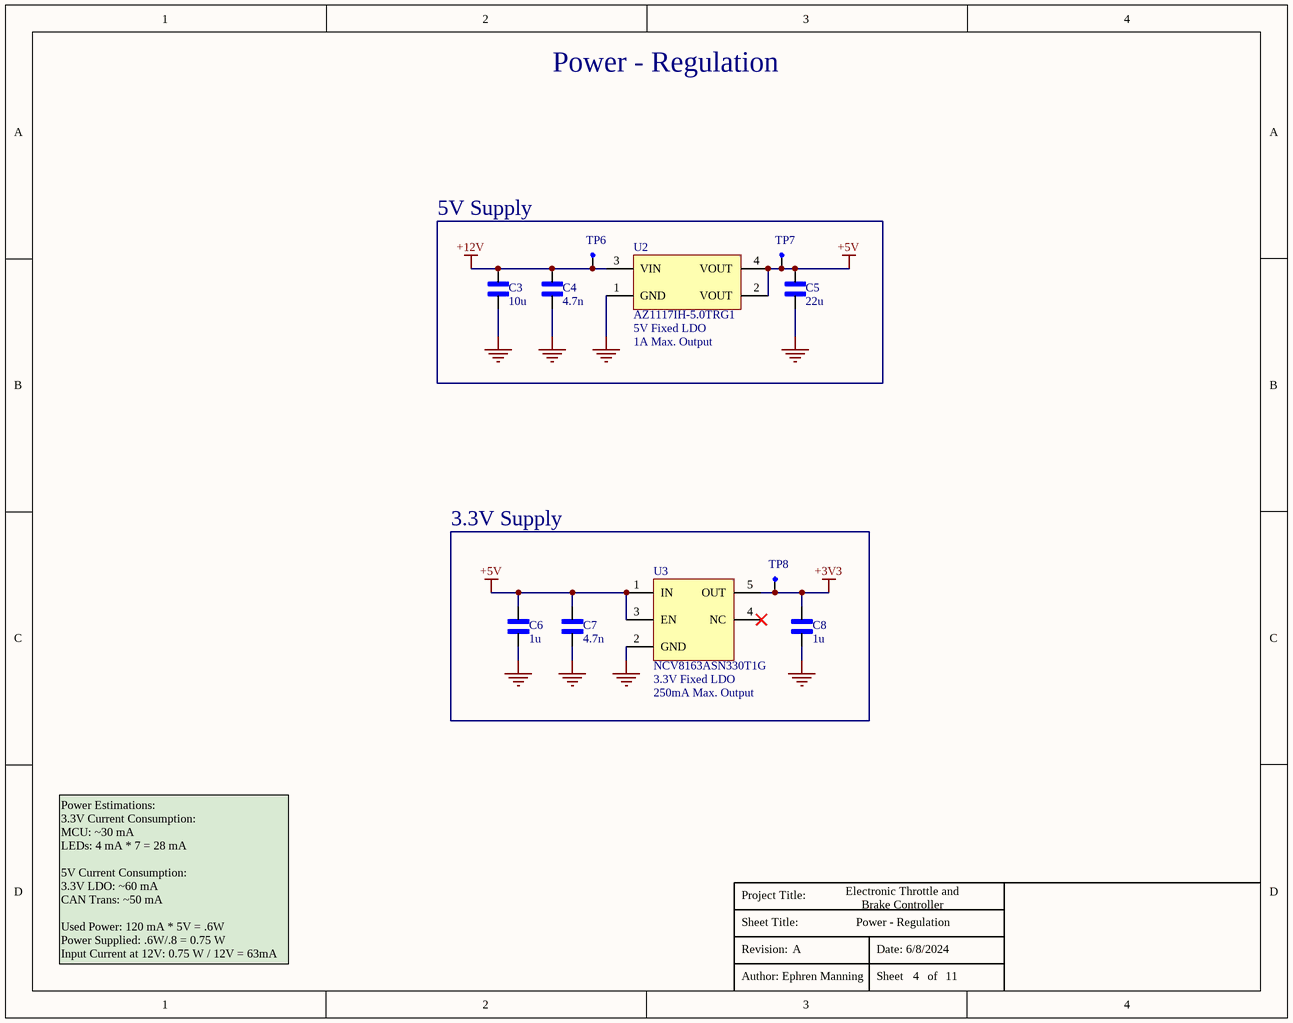
[diagram p8: Power - Regulation.SchDoc]

### Parts
C3  10u  [CAP_1210-Footprint-1]
C4  4.7n  [CAP_0402-Footprint-1]
C5  22u  [CAP_1206-Footprint-1]
C6  1u  [CAP_0805-Footprint-1]
C7  4.7n  [CAP_0402-Footprint-1]
C8  1u  [CAP_0805-Footprint-1]
TP6  SMD Testpoint  [SMD Testpoint-Footprint-1]  (value not drawn)
TP7  SMD Testpoint  [SMD Testpoint-Footprint-1]  (value not drawn)
TP8  SMD Testpoint  [SMD Testpoint-Footprint-1]  (value not drawn)
U2  AZ1117IH-5.0TRG1  [SOT230P700X180-4N]
U3  NCV8163ASN330T1G  [SOT95P275X110-5N]

### Blocks framed on the sheet
5V Supply: C3-C5 TP6 TP7 U2
3.3V Supply: C6-C8 TP8 U3

### Nets
+3V3: C8.2 TP8.1 U3.5(OUT)
+5V: C5.2 C6.2 C7.2 TP7.1 U2.2(VOUT) U2.4(VOUT) U3.1(IN) U3.3(EN)
+12V: C3.2 C4.2 TP6.1 U2.3(VIN)
GND: C3.1 C4.1 C5.1 C6.1 C7.1 C8.1 U2.1(GND) U3.2(GND)

Not connected (* = marked no-connect by the designer): U3 4(NC)*

### Notes on the sheet
- Power - Regulation
- (near U2) 5V Fixed LDO
- (near U2) 1A Max. Output
- (near U3) 3.3V Fixed LDO
- (near U3) 250mA Max. Output
- Electronic Throttle and
  Brake Controller
- Power Estimations:
  3.3V Current Consumption:
  MCU: ~30 mA
  LEDs: 4 mA * 7 = 28 mA
  5V Current Consumption:
  3.3V LDO: ~60 mA
  CAN Trans: ~50 mA
  Used Power: 120 mA * 5V = .6W
  Power Supplied: .6W/.8 = 0.75 W
  Input Current at 12V: 0.75 W / 12V = 63mA
- A
- 6/8/2024
- Ephren Manning
- 4
- 11
- Project Title:
- Sheet Title:
- Revision:
- Date:
- Author:
- Sheet        of

### Library data of the parts
C3 = CMP-00102-1: 10uF 35V 10% 1210 MLCC; Manufacturer 1: Samsung Electro-Mechanics; Manufacturer Part Number 1: CL32B106KLJNNNE; Digikey Part Number: 1276-3389-1-ND
C4 C7 = CMP-00072-1: as C17 on sheet Interface - CAN; Digikey Part Number: 490-4765-1-ND
C5 = CMP-00099-3: 22uF 10V 20% 1206 MLCC; Manufacturer 1: Samsung Electro-Mechanics; Manufacturer Part Number 1: CL31B226MPHNNNE; Digikey Part Number: 1276-3148-1-ND
C6 C8 = CMP-00097-2: 1uF 25V 10% 0805 MLCC; Manufacturer 1: Samsung Electro-Mechanics; Manufacturer Part Number 1: CL21B105KAFNNNE; Digikey Part Number: 1276-1066-1-ND
TP6-TP8 = CMP-00095-4: Flat 50x50mil Test Point
U2 = CMP-00103-1: 5V Fixed Linear Regulator; Manufacturer 1: Diodes Incorporated; Manufacturer Part Number1: AZ1117IH-5.0TRG1; Digikey Part Number: AZ1117IH-5.0TRG1DICT-ND
U3 = CMP-00082-1: 3.3V LDO, Ultra Low Noise 5.5V Max Vin; Manufacturer 1: onsemi; Manufacturer Part Number 1: NCV8163ASN330T1G; Digikey Part Number: NCV8163ASN330T1GOSCT-ND

## Sheet User - Input.SchDoc
size A; SheetNumber: 8; SheetTotal: 11
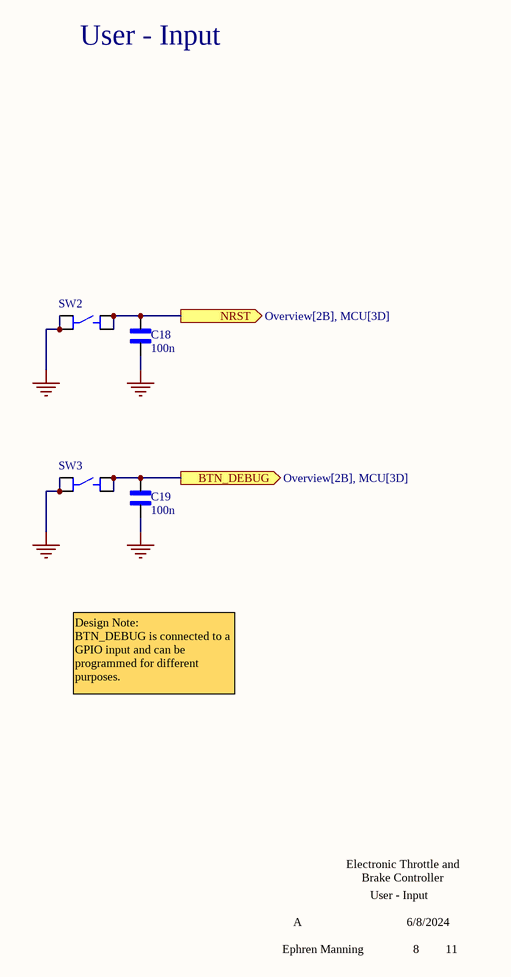
[diagram p9: User - Input.SchDoc]

### Parts
C18  100n  [CAP_0402-Footprint-1]
C19  100n  [CAP_0402-Footprint-1]
SW2  PTS810_SJM_250_SMTR_LFS  [SW_PTS810_SJM_250_SMTR_LFS]  (value not drawn)
SW3  PTS810_SJM_250_SMTR_LFS  [SW_PTS810_SJM_250_SMTR_LFS]  (value not drawn)

### Ports
BTN_DEBUG (out, see Overview[2B], MCU[3D]), NRST (out, see Overview[2B], MCU[3D])

### Nets
GND: C18.1 C19.1 SW2.1 SW2.2 SW3.1 SW3.2
BTN_DEBUG: C19.2 SW3.3 SW3.4 ; port BTN_DEBUG
NRST: C18.2 SW2.3 SW2.4 ; port NRST

### Notes on the sheet
- User - Input
- Design Note:
  BTN_DEBUG is connected to a GPIO input and can be programmed for different purposes.
- Electronic Throttle and
  Brake Controller
- A
- 6/8/2024
- Ephren Manning
- 8
- 11
- Project Title:
- Sheet Title:
- Revision:
- Date:
- Author:
- Sheet        of

### Library data of the parts
C18 C19 = CMP-00066-3: as C28 on sheet Interface - EEPROM; Digikey Part Number: 1276-1002-1-ND
SW2 SW3 = CMP-014-000000-4: Tactile Switch SPST-NO Top Actuated Surface Mount; Manufacturer Part Number 1: PTS810 SJM 250 SMTR LFS; Manufacturer 1: C&K; Digikey Part Number: CKN10502CT-ND

## Sheet User - LED Indicators.SchDoc
size A; SheetNumber: 9; SheetTotal: 11
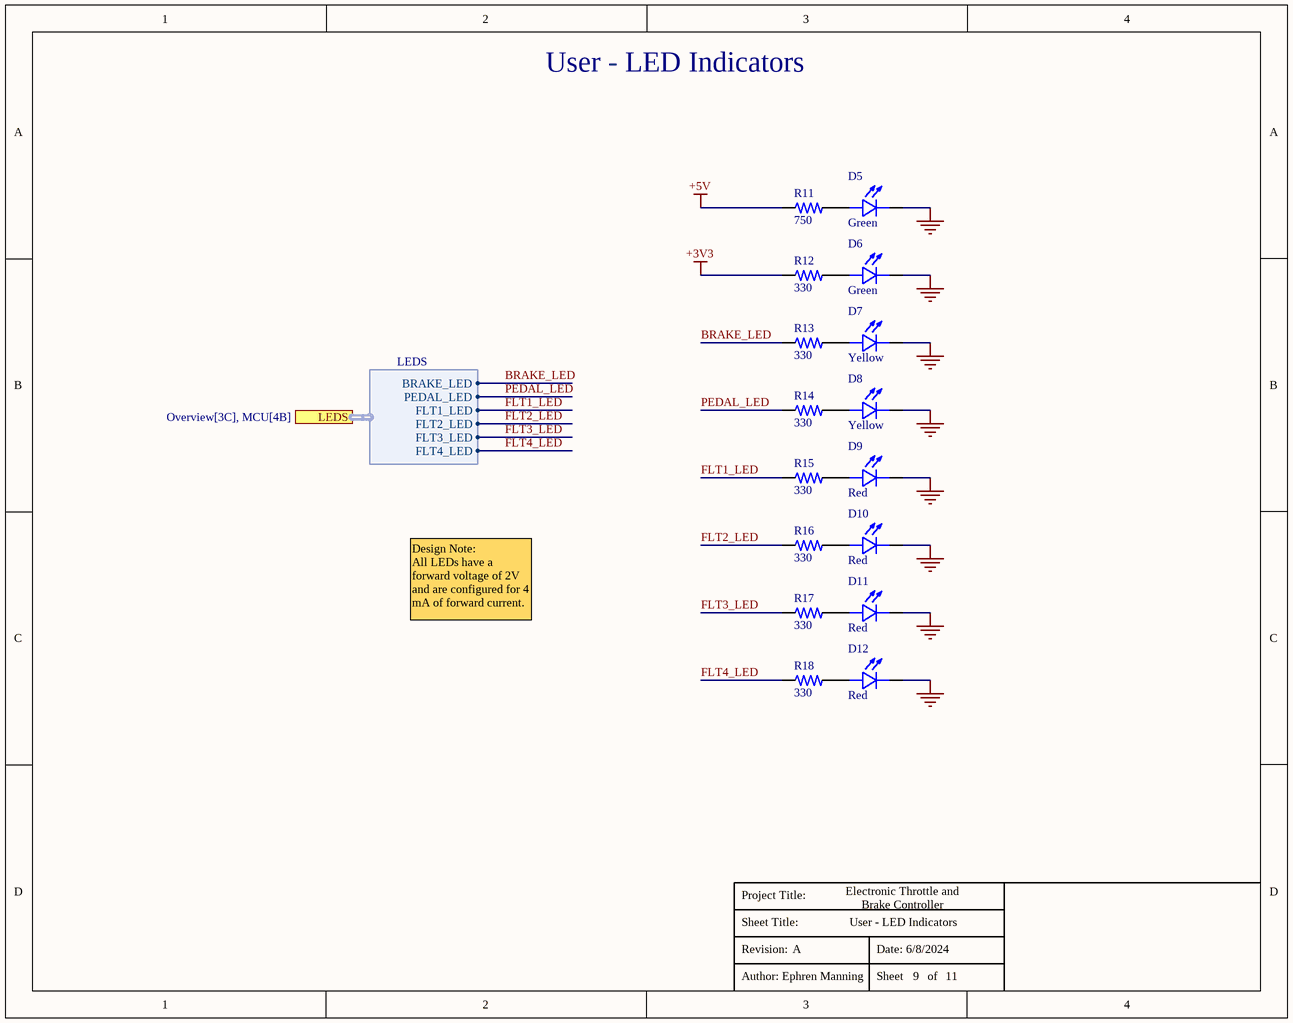
[diagram p10: User - LED Indicators.SchDoc]

### Parts
D5  Green  [Wurth-LED-0603-Footprint]
D6  Green  [Wurth-LED-0603-Footprint]
D7  Yellow  [Wurth-LED-0603-Footprint]
D8  Yellow  [Wurth-LED-0603-Footprint]
D9  Red  [LED_150060RS75000]
D10  Red  [LED_150060RS75000]
D11  Red  [LED_150060RS75000]
D12  Red  [LED_150060RS75000]
R11  750  [RES_0402-Footprint-1]
R12  330  [RES_0402-Footprint-1]
R13  330  [RES_0402-Footprint-1]
R14  330  [RES_0402-Footprint-1]
R15  330  [RES_0402-Footprint-1]
R16  330  [RES_0402-Footprint-1]
R17  330  [RES_0402-Footprint-1]
R18  330  [RES_0402-Footprint-1]

### Ports
LEDS (harness LEDS, see Overview[3C], MCU[4B])

### Harnesses
LEDS: BRAKE_LED, PEDAL_LED, FLT1_LED, FLT2_LED, FLT3_LED, FLT4_LED

### Nets
+3V3: R12.1
+5V: R11.1
GND: D5.C D6.C D7.C D8.C D9.C D10.C D11.C D12.C
BRAKE_LED: R13.1 ; port LEDS.BRAKE_LED
FLT1_LED: R15.1 ; port LEDS.FLT1_LED
FLT2_LED: R16.1 ; port LEDS.FLT2_LED
FLT3_LED: R17.1 ; port LEDS.FLT3_LED
FLT4_LED: R18.1 ; port LEDS.FLT4_LED
PEDAL_LED: R14.1 ; port LEDS.PEDAL_LED
NetD5_A: D5.A R11.2
NetD6_A: D6.A R12.2
NetD7_A: D7.A R13.2
NetD8_A: D8.A R14.2
NetD9_A: D9.A R15.2
NetD10_A: D10.A R16.2
NetD11_A: D11.A R17.2
NetD12_A: D12.A R18.2

### Notes on the sheet
- User - LED Indicators
- Design Note:
  All LEDs have a forward voltage of 2V and are configured for 4 mA of forward current.
- Electronic Throttle and
  Brake Controller
- A
- 6/8/2024
- Ephren Manning
- 9
- 11
- Project Title:
- Sheet Title:
- Revision:
- Date:
- Author:
- Sheet        of

### Library data of the parts
D5 D6 = CMP-00076-2: LED GREEN CLEAR 0603 2V Forward Voltage; Manufacturer 1: Würth Elektronik; Manufacturer Part Number 1: 150060VS75000; Digikey Part Number: 732-4980-1-ND
D7 D8 = CMP-00077-1: LED YELLOW CLEAR 0603 2V Forward Voltage; Manufacturer 1: Würth Elektronik; Manufacturer Part Number 1: 150060YS75000; Digikey Part Number: 732-4981-1-ND
D9-D12 = CMP-120-000000-3: as D1 on sheet Power - Input; Manufacturer Part Number 1: 150060RS75000; Digikey Part Number: 732-4978-1-ND
R11 = CMP-00078-1: as R1 on sheet Power - Input; Digikey Part Number: 311-750LRCT-ND
R12-R18 = CMP-00079-1: 330 1% 1/16W 0402 Thick Film; Manufacturer Part Number 1: RC0402FR-07330RL; Manufacturer 1: YAGEO; Digikey Part Number: 311-330LRCT-ND

## Nets that join several sheets
+3V3: MCU (6 pins), Interface - EEPROM (6 pins), Interface - CAN (C16.2 U5.5), Interface - Debug (J5.1), Input - Pedals (R20.1 R21.2 R27.1 R28.2), Power - Regulation (C8.2 TP8.1 U3.5), User - LED Indicators (R12.1)
+5V: Interface - CAN (C15.2 U5.3), Interface - Debug (D3.2 TP12.1), Input - Pedals (R19.1 R26.1), Power - Regulation (8 pins), User - LED Indicators (R11.1)
+12V: Power - Input (U1.5), Power - Regulation (C3.2 C4.2 TP6.1 U2.3)
GND: MCU (9 pins), Interface - EEPROM (C28.1 U8.3 U8.4), Interface - CAN (5 pins), Interface - Debug (5 pins), Input - Pedals (18 pins), Power - Input (9 pins), Power - Regulation (8 pins), User - Input (6 pins), User - LED Indicators (8 pins)
ADC_IN2: MCU (U4.13), Input - Pedals (C20.2 R22.2 R23.2)
ADC_IN3: MCU (U4.14), Input - Pedals (C23.2 R24.2 R25.2)
ADC_IN4: MCU (U4.15), Input - Pedals (C24.2 R29.2 R30.2)
ADC_IN5: MCU (U4.16), Input - Pedals (C27.2 R31.2 R32.2)
APPS_EN: MCU (U4.11), Input - Pedals (U6.3)
APPS_~{FLT}: MCU (U4.12), Input - Pedals (R21.1 U6.4)
BRAKE_LED: MCU (U4.22), User - LED Indicators (R13.1)
BSE_EN: MCU (U4.17), Input - Pedals (U7.3)
BSE_~{FLT}: MCU (U4.18), Input - Pedals (R28.1 U7.4)
BTN_DEBUG: MCU (U4.48), User - Input (C19.2 SW3.3 SW3.4)
CAN1_RX: MCU (U4.38), Interface - CAN (U5.4)
CAN1_S: MCU (U4.37), Interface - CAN (U5.8)
CAN1_TX: MCU (U4.39), Interface - CAN (U5.1)
EEPROM_~{WC}: MCU (U4.28), Interface - EEPROM (U8.7)
FLT1_LED: MCU (U4.24), User - LED Indicators (R15.1)
FLT2_LED: MCU (U4.25), User - LED Indicators (R16.1)
FLT3_LED: MCU (U4.26), User - LED Indicators (R17.1)
FLT4_LED: MCU (U4.27), User - LED Indicators (R18.1)
I2C1_SCL: MCU (U4.29), Interface - EEPROM (R34.1 U8.6)
I2C1_SDA: MCU (U4.32), Interface - EEPROM (R33.1 U8.5)
NRST: MCU (U4.10), Interface - Debug (J5.10), User - Input (C18.2 SW2.3 SW2.4)
PEDAL_LED: MCU (U4.23), User - LED Indicators (R14.1)
SWCLK: MCU (U4.36), Interface - Debug (J5.4)
SWDIO: MCU (U4.35), Interface - Debug (J5.2)
USB_N: MCU (U4.33), Interface - Debug (D4.3 J6.2)
USB_P: MCU (U4.34), Interface - Debug (D4.2 J6.3)